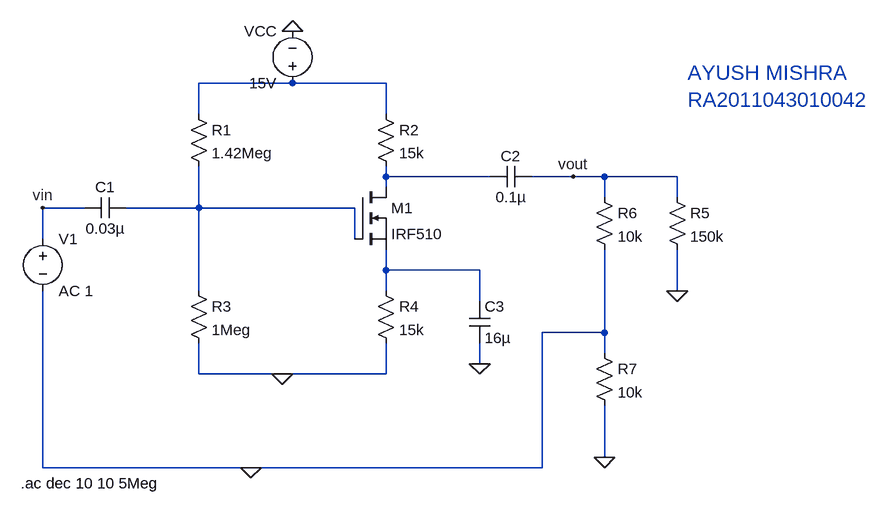
[diagram p0: schematic exp 2b.asc]
exp 2b.asc, the LTspice schematic file:
Version 4
SHEET 1 2084 680
WIRE 432 -80 288 -80
WIRE 576 -80 432 -80
WIRE 288 -32 288 -80
WIRE 576 -32 576 -80
WIRE 576 64 576 48
WIRE 736 64 576 64
WIRE 864 64 800 64
WIRE 912 64 864 64
WIRE 1024 64 912 64
WIRE 576 80 576 64
WIRE 912 96 912 64
WIRE 1024 96 1024 64
WIRE 112 112 48 112
WIRE 288 112 288 48
WIRE 288 112 176 112
WIRE 528 112 288 112
WIRE 48 160 48 112
WIRE 528 160 528 112
WIRE 576 208 576 176
WIRE 720 208 576 208
WIRE 288 240 288 112
WIRE 576 240 576 208
WIRE 1024 240 1024 176
WIRE 720 256 720 208
WIRE 912 304 912 176
WIRE 912 304 816 304
WIRE 912 336 912 304
WIRE 720 352 720 320
WIRE 288 368 288 320
WIRE 416 368 288 368
WIRE 576 368 576 320
WIRE 576 368 416 368
WIRE 912 496 912 416
WIRE 48 512 48 240
WIRE 368 512 48 512
WIRE 816 512 816 304
WIRE 816 512 368 512
FLAG 432 -160 0
FLAG 416 368 0
FLAG 368 512 0
FLAG 720 352 0
FLAG 912 496 0
FLAG 1024 240 0
FLAG 48 112 vin
FLAG 864 64 vout
SYMBOL voltage 48 144 R0
WINDOW 123 0 0 Left 0
WINDOW 39 0 0 Left 0
SYMATTR InstName V1
SYMATTR Value AC 1
SYMBOL voltage 432 -64 R180
WINDOW 0 24 96 Left 2
WINDOW 3 24 16 Left 2
WINDOW 123 0 0 Left 0
WINDOW 39 0 0 Left 0
SYMATTR InstName VCC
SYMATTR Value 15V
SYMBOL res 272 -48 R0
SYMATTR InstName R1
SYMATTR Value 1.42Meg
SYMBOL res 560 -48 R0
SYMATTR InstName R2
SYMATTR Value 15k
SYMBOL res 272 224 R0
SYMATTR InstName R3
SYMATTR Value 1Meg
SYMBOL res 560 224 R0
SYMATTR InstName R4
SYMATTR Value 15k
SYMBOL res 1008 80 R0
SYMATTR InstName R5
SYMATTR Value 150k
SYMBOL res 896 80 R0
SYMATTR InstName R6
SYMATTR Value 10k
SYMBOL nmos 528 80 R0
SYMATTR InstName M1
SYMATTR Value IRF510
SYMBOL cap 176 96 R90
WINDOW 0 0 32 VBottom 2
WINDOW 3 32 32 VTop 2
SYMATTR InstName C1
SYMATTR Value 0.03µ
SYMBOL cap 736 80 R270
WINDOW 0 32 32 VTop 2
WINDOW 3 0 32 VBottom 2
SYMATTR InstName C2
SYMATTR Value 0.1µ
SYMBOL cap 704 256 R0
SYMATTR InstName C3
SYMATTR Value 16µ
SYMBOL res 896 320 R0
SYMATTR InstName R7
SYMATTR Value 10k
TEXT 14 536 Left 2 !.ac dec 10 10 5Meg
TEXT 1040 -96 Left 3 ;AYUSH MISHRA \nRA2011043010042

The netlist it stands for:
* exp 2b.asc
V1 vin 0 AC 1
VCC N001 0 15V
R1 N001 N003 1.42Meg
R2 N001 N002 15k
R3 N003 0 1Meg
R4 N004 0 15k
R5 vout 0 150k
R6 vout 0 10k
M1 N002 N003 N004 N004 IRF510
C1 N003 vin 0.03µ
C2 N002 vout 0.1µ
C3 N004 0 16µ
R7 0 0 10k
.model NMOS NMOS
.model PMOS PMOS
.lib standard.mos
.ac dec 10 10 5Meg
* AYUSH MISHRA
* RA2011043010042
.backanno
.end